# Altium schematic sheet BMX160.SchDoc
size A4; SheetNumber: 2; SheetTotal: 6
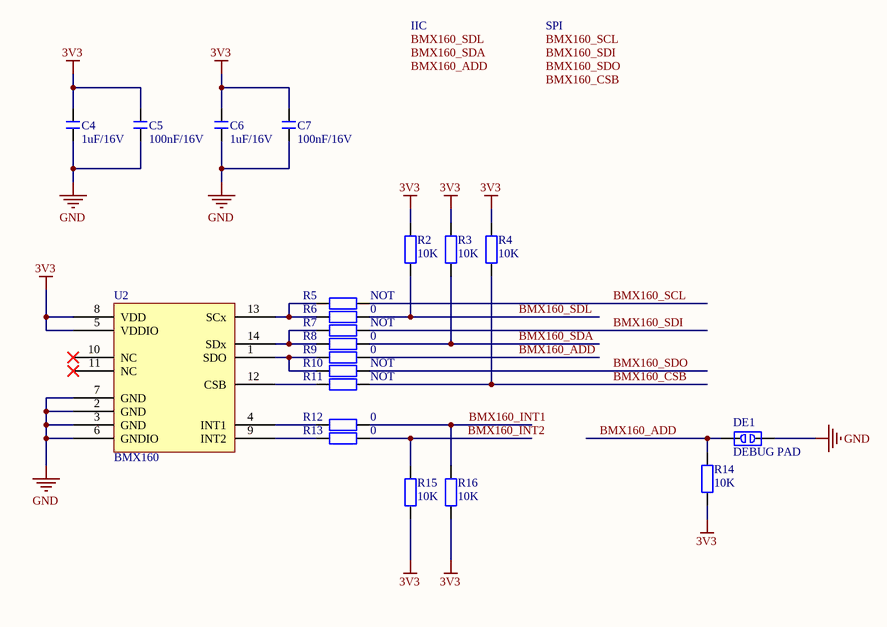
[diagram p0: BMX160.SchDoc]

## Parts
C4  1uF/16V  [C 0402_L]
C5  100nF/16V  [C 0402_L]
C6  1uF/16V  [C 0402_L]
C7  100nF/16V  [C 0402_L]
DE1  DEBUG PAD  [DEBUG_A]
R2  10K  [R 0402_L]
R3  10K  [R 0402_L]
R4  10K  [R 0402_L]
R5  NOT  [R 0402_L]
R6  0  [R 0402_L]
R7  NOT  [R 0402_L]
R8  0  [R 0402_L]
R9  0  [R 0402_L]
R10  NOT  [R 0402_L]
R11  NOT  [R 0402_L]
R12  0  [R 0402_L]
R13  0  [R 0402_L]
R14  10K  [R 0402_L]
R15  10K  [R 0402_L]
R16  10K  [R 0402_L]
U2  BMX160  [BMX160]

## Nets
3V3: C4.2 C5.1 C6.2 C7.1 R2.1 R3.1 R4.1 R14.1 R15.1 R16.1 U2.5(VDDIO) U2.8(VDD)
GND: C4.1 C5.2 C6.1 C7.2 DE1.2 U2.2(GND) U2.3(GND) U2.6(GNDIO) U2.7(GND)
BMX160_ADD: DE1.1 R9.1 R14.2
BMX160_CSB: R4.2 R11.1
BMX160_INT1: R12.1 R16.2
BMX160_INT2: R13.1 R15.2
BMX160_SCL: R5.1
BMX160_SDA: R3.2 R8.1
BMX160_SDI: R7.1
BMX160_SDL: R2.2 R6.1
BMX160_SDO: R10.1
NetR5_2: R5.2 R6.2 U2.13(SCx)
NetR7_2: R7.2 R8.2 U2.14(SDx)
NetR9_2: R9.2 R10.2 U2.1(SDO)
NetR11_2: R11.2 U2.12(CSB)
NetR12_2: R12.2 U2.4(INT1)
NetR13_2: R13.2 U2.9(INT2)

Not connected (* = marked no-connect by the designer): U2 10(NC)* 11(NC)*

## Notes on the sheet
- IIC
- SPI
- Labels drawn without touching a wire or pin: BMX160_ADD, BMX160_CSB, BMX160_SCL, BMX160_SDA, BMX160_SDI, BMX160_SDL, BMX160_SDO

## Library data of the parts
C4 C6 = C: 贴片电容; 主类型: 电容; 值精度: ±10%; 元件封装: 0402; 具体类型: 陶瓷电容; 封装类型: 贴片; 温度漂移: X5R; 生产商: SAMSUNG(三星); 生产商零件编码: CL05A105KO5NNNC; 值/型号: 1uF/16V; 立创编号: C29266
C5 C7 = C: 无极性贴片电容; 主类型: 电容; 封装类型: 贴片; 生产商: YAGEO(国巨); 生产商零件编码: CC0402KRX7R7BB104; 值/型号: 100nF/16V; 元件封装: *; 具体类型: *; 温度漂移: *; 温度范围: *; 立创编号: C60474; 类型备注: *; 手册网址: *; 官网地址: *
DE1 = DEBUG: 调试断点焊盘; 版权归属: 源创客; BOM名称: 调试断点焊盘; 学习资源: www.ooocke.com
R2-R4 R14-R16 = R: 贴片电阻 0402 1%; 主类型: 电阻; 元件封装: 0402; 封装类型: 贴片; 温度漂移: ±100ppm/℃; 生产商: 国巨; 生产商零件编码: RC0402FR-0710KL; 值/型号: 10K; 值精度: ±1%; 具体类型: 贴片电阻; 立创编号: C60490
R5 R7 R10 R11 = R: 贴片电阻; 主类型: 电阻; 值/型号: 0; 元件封装: 0402; 封装类型: 贴片; 生产商: YAGEO（国巨）; 生产商零件编码: RC0402FR-0710KL; 立创编号: C60490
R6 R8 R9 R12 R13 = R: 贴片电阻; 主类型: 电阻; 元件封装: 0402; 封装类型: 贴片; 生产商: YAGEO（国巨）; 生产商零件编码: RC0402FR-0710KL; 值/型号: 0; 立创编号: C60490